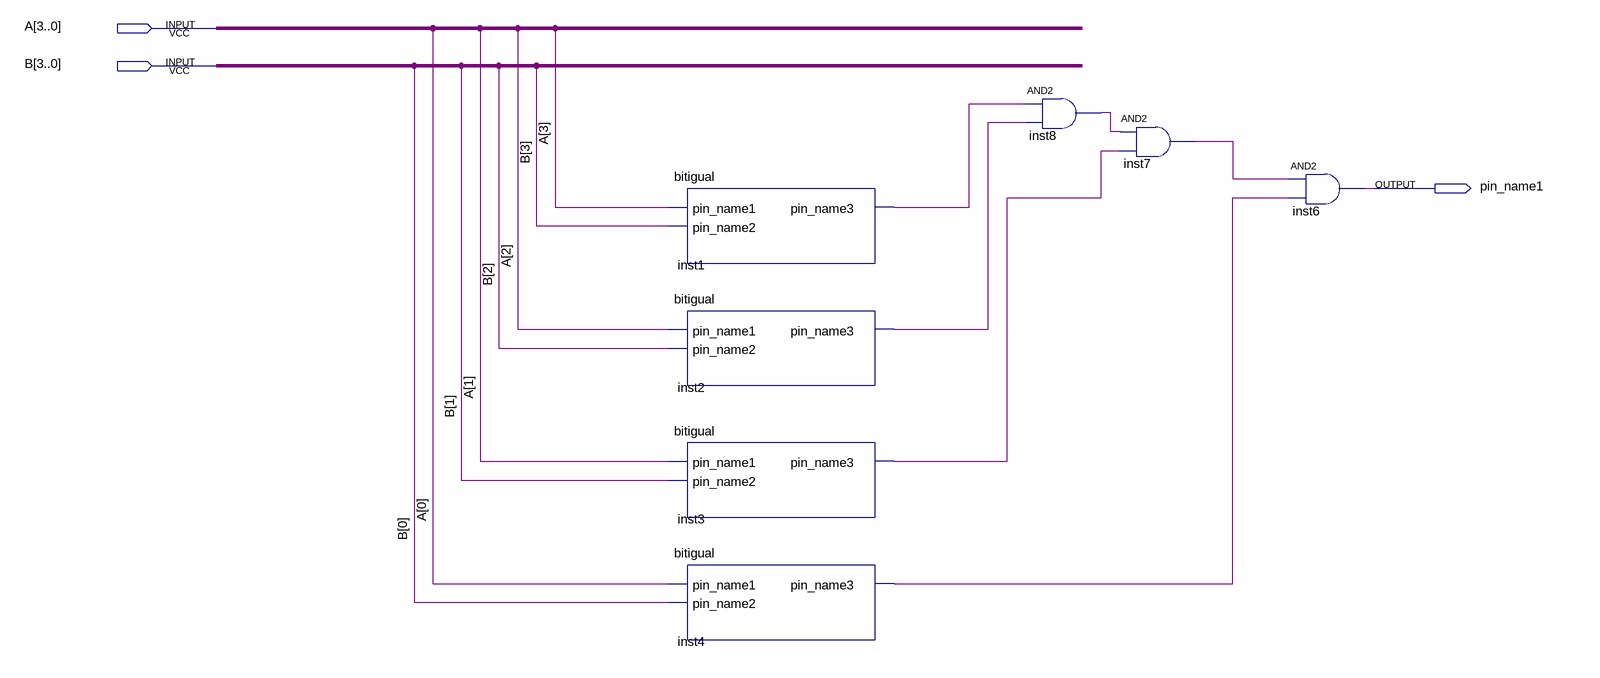
[diagram p0: schematic sheet]
// Quartus schematic numerosiguaismodulo.bdf as structural Verilog: 7 symbols, 3 pins
module numerosiguaismodulo (
  input  [3:0] A,
  input  [3:0] B,
  output pin_name1
);

  wire inst1_pin_name3, inst2_pin_name3, inst3_pin_name3, inst4_pin_name3, inst7_out, inst8_out;

  bitigual inst1 (.pin_name1(A[3]), .pin_name2(B[3]), .pin_name3(inst1_pin_name3));
  bitigual inst2 (.pin_name1(A[2]), .pin_name2(B[2]), .pin_name3(inst2_pin_name3));
  bitigual inst3 (.pin_name1(A[1]), .pin_name2(B[1]), .pin_name3(inst3_pin_name3));
  bitigual inst4 (.pin_name1(A[0]), .pin_name2(B[0]), .pin_name3(inst4_pin_name3));
  and inst8 (inst8_out, inst1_pin_name3, inst2_pin_name3);
  and inst7 (inst7_out, inst8_out, inst3_pin_name3);
  and inst6 (pin_name1, inst7_out, inst4_pin_name3);
endmodule
